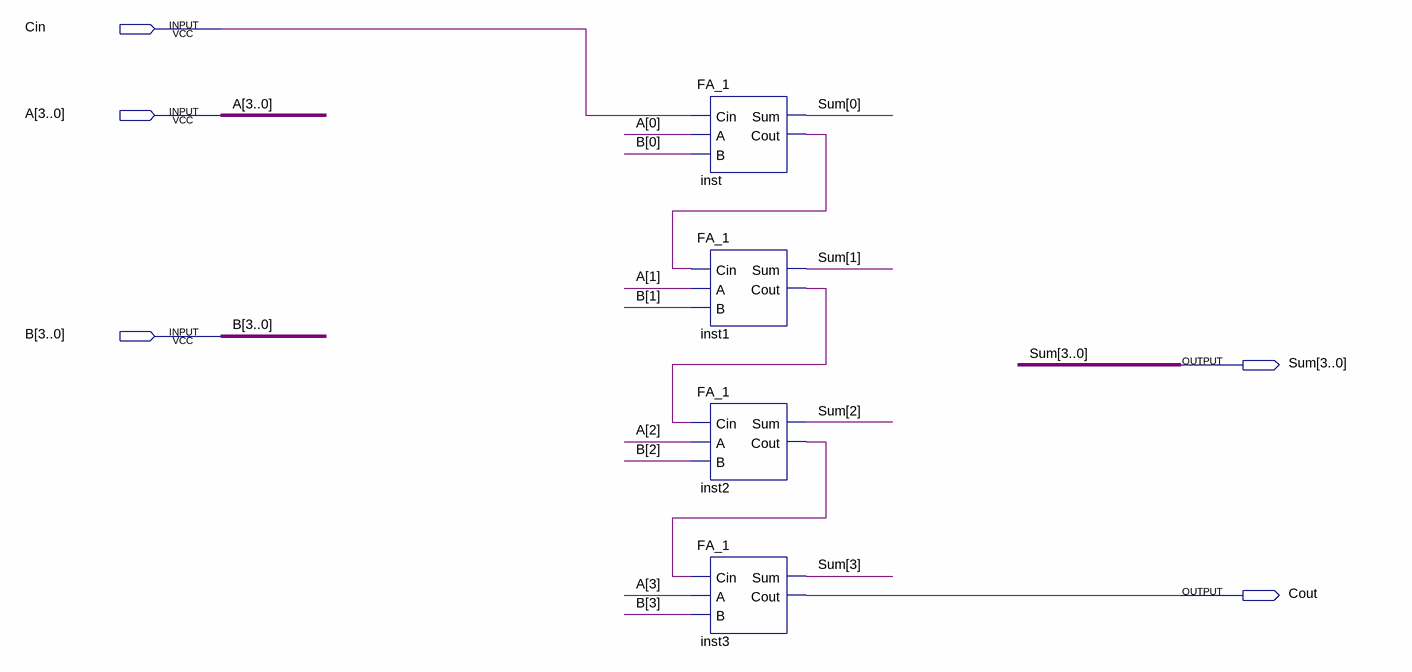
[diagram p0: schematic sheet]
// Quartus schematic FA_4.bdf as structural Verilog: 4 symbols, 5 pins
module FA_4 (
  input  Cin,
  input  [3:0] A,
  input  [3:0] B,
  output [3:0] Sum,
  output Cout
);

  wire inst1_cout, inst2_cout, inst_cout;

  FA_1 inst (.Cin(Cin), .A(A[0]), .B(B[0]), .Sum(Sum[0]), .Cout(inst_cout));
  FA_1 inst1 (.Cin(inst_cout), .A(A[1]), .B(B[1]), .Sum(Sum[1]), .Cout(inst1_cout));
  FA_1 inst2 (.Cin(inst1_cout), .A(A[2]), .B(B[2]), .Sum(Sum[2]), .Cout(inst2_cout));
  FA_1 inst3 (.Cin(inst2_cout), .A(A[3]), .B(B[3]), .Sum(Sum[3]), .Cout(Cout));
endmodule
